# EasyEDA schematic schematic.json
TITLE: PFS154 Arduino programmer; REV: 1.0; Date: 2019-09-02; Sheet: 1/1; Drawn By: socram8888; Company: orca.pet
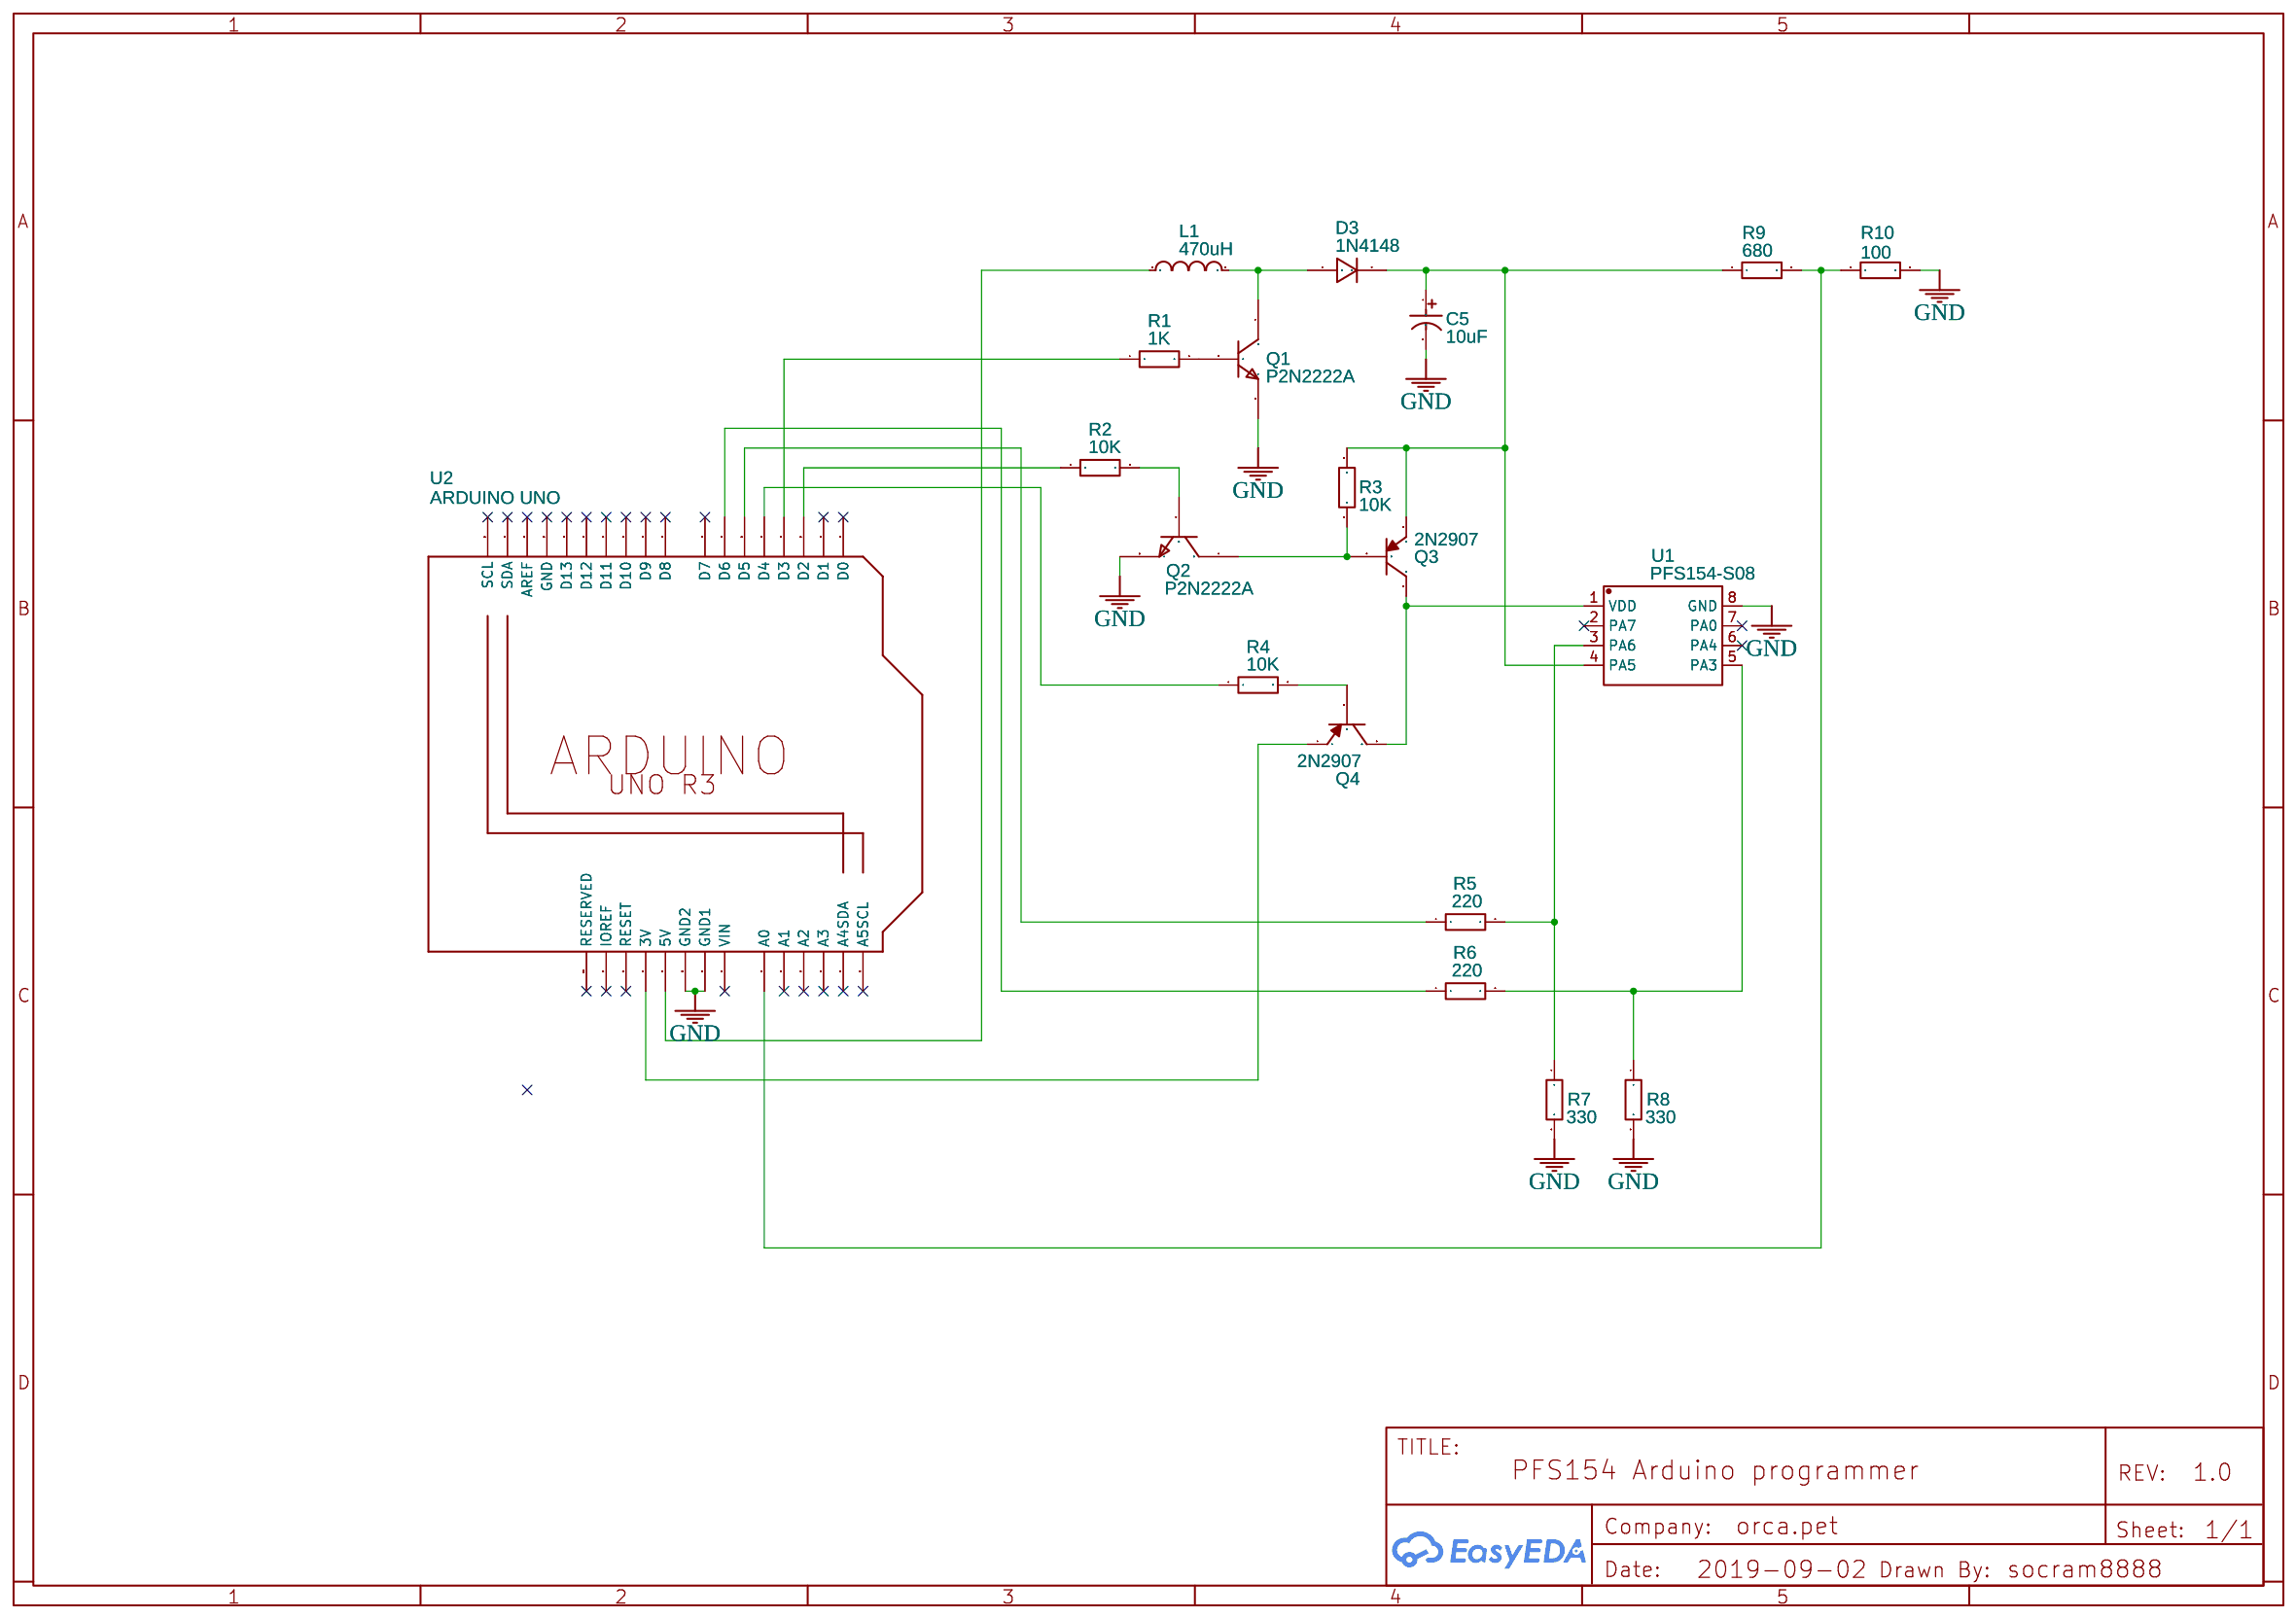
[diagram p0: schematic sheet]

## Parts
C5  10uF  [CAP-D4.0XF1.5]
D3  1N4148  [DO-35G]
L1  470uH  [IND-VL0810]
Q1  P2N2222A  [TO-92(TO-92-3)-2.54]
Q2  P2N2222A  [TO-92(TO-92-3)-2.54]
Q3  2N2907  [TO-92(TO-92-3)-2.54]
Q4  2N2907  [TO-92(TO-92-3)-2.54]
R1  1K  [AXIAL-0.3]
R2  10K  [AXIAL-0.3]
R3  10K  [AXIAL-0.3]
R4  10K  [AXIAL-0.3]
R5  220  [AXIAL-0.3]
R6  220  [AXIAL-0.3]
R7  330  [AXIAL-0.3]
R8  330  [AXIAL-0.3]
R9  680  [AXIAL-0.3]
R10  100  [AXIAL-0.3]
U1  PFS154-S08  [PDIP-8_8PIN-LS7.62-L9.83-W6.60-PITCH2.54-BL]
U2  ARDUINO UNO  [ARDUINOR3]

## Library data of the parts
C5 = 10uF 25V 4*7: Supplier: LCSC; Manufacturer: ValuePro; Supplier Part: C43351
D3 = -: Supplier Part: C163750; Supplier: LCSC; Manufacturer: FMS; Contributor: LCSC
L1 = VLU0810-471K: Supplier: LCSC; Manufacturer: FH; Supplier Part: C72619
Q1 Q2 = -: Amplifier Transistor NPN Silicon; sourceId: TPVZ40oL8
Q3 Q4 = -: Supplier: LCSC; Manufacturer: SEMTECH; Supplier Part: C118537
R1-R4 = MF1/8W ±2% 1Ω8 OTB5: Supplier: LCSC; Supplier Part: C337047; Manufacturer: FlyWin; Contributor: LCSC
R5 R6 = MF1/8W ±1% 220Ω OTB5: Supplier: LCSC; Supplier Part: C337127; Manufacturer: FlyWin; Contributor: LCSC
R7 R8 = MFR0W8F3300A50: Supplier: LCSC; Supplier Part: C81959; Manufacturer: Uniroyal Elec; Contributor: LCSC
R9 = MFR-25FTE52-680K: Supplier: LCSC; Supplier Part: C173038; Manufacturer: YAGEO; Contributor: LCSC
R10 = MFR-25FTE52-68R: Supplier: LCSC; Supplier Part: C173041; Manufacturer: YAGEO; Contributor: LCSC
U1 = -: Supplier: LCSC; Supplier Part: C317611; Manufacturer: PADAUK Tech; Contributor: LCSC
U2 = -: This is a new object for the new Arduino R3 - with extra pins that you may want to use (such as IOref, and duplicated A4A5; Contributor: Adafruit

## Nets
GND: C5.2 Q1.3(E) Q2.3(E) R7.2 R8.2 R10.2 U1.8(GND) U2.GND1 U2.GND2
Net-(C5-1): C5.1 D3.2 Q3.1(E) R3.2 R9.1 U1.4(PA5)
Net-(D3-1): D3.1 L1.2 Q1.1(C)
Net-(L1-1): L1.1 U2.5V
Net-(Q1-2): Q1.2(B) R1.2
Net-(Q2-1): Q2.1(C) Q3.2(B) R3.1
Net-(Q2-2): Q2.2(B) R2.2
Net-(Q3-3): Q3.3(C) Q4.3(C) U1.1(VDD)
Net-(Q4-1): Q4.1(E) U2.3V
Net-(Q4-2): Q4.2(B) R4.2
Net-(R1-1): R1.1 U2.D3
Net-(R2-1): R2.1 U2.D2
Net-(R4-1): R4.1 U2.D4
Net-(R5-1): R5.1 U2.D5
Net-(R5-2): R5.2 R7.1 U1.3(PA6)
Net-(R6-1): R6.1 U2.D6
Net-(R6-2): R6.2 R8.1 U1.5(PA3)
Net-(R9-2): R9.2 R10.1 U2.A0

Not connected (* = marked no-connect by the designer): U1 2(PA7)* 6(PA4)* 7(PA0)*; U2 A1* A2* A3* A4(A4SDA)* A5(A5SCL)* AREF* D0* D1* D7* D8* D9* D10* D11* D12* D13* GND* IOREF* RESERVED* RESET* SCL* SDA* VIN*
